# EAGLE design FabScan-Shield_v10 (EAGLE 6.6.0)
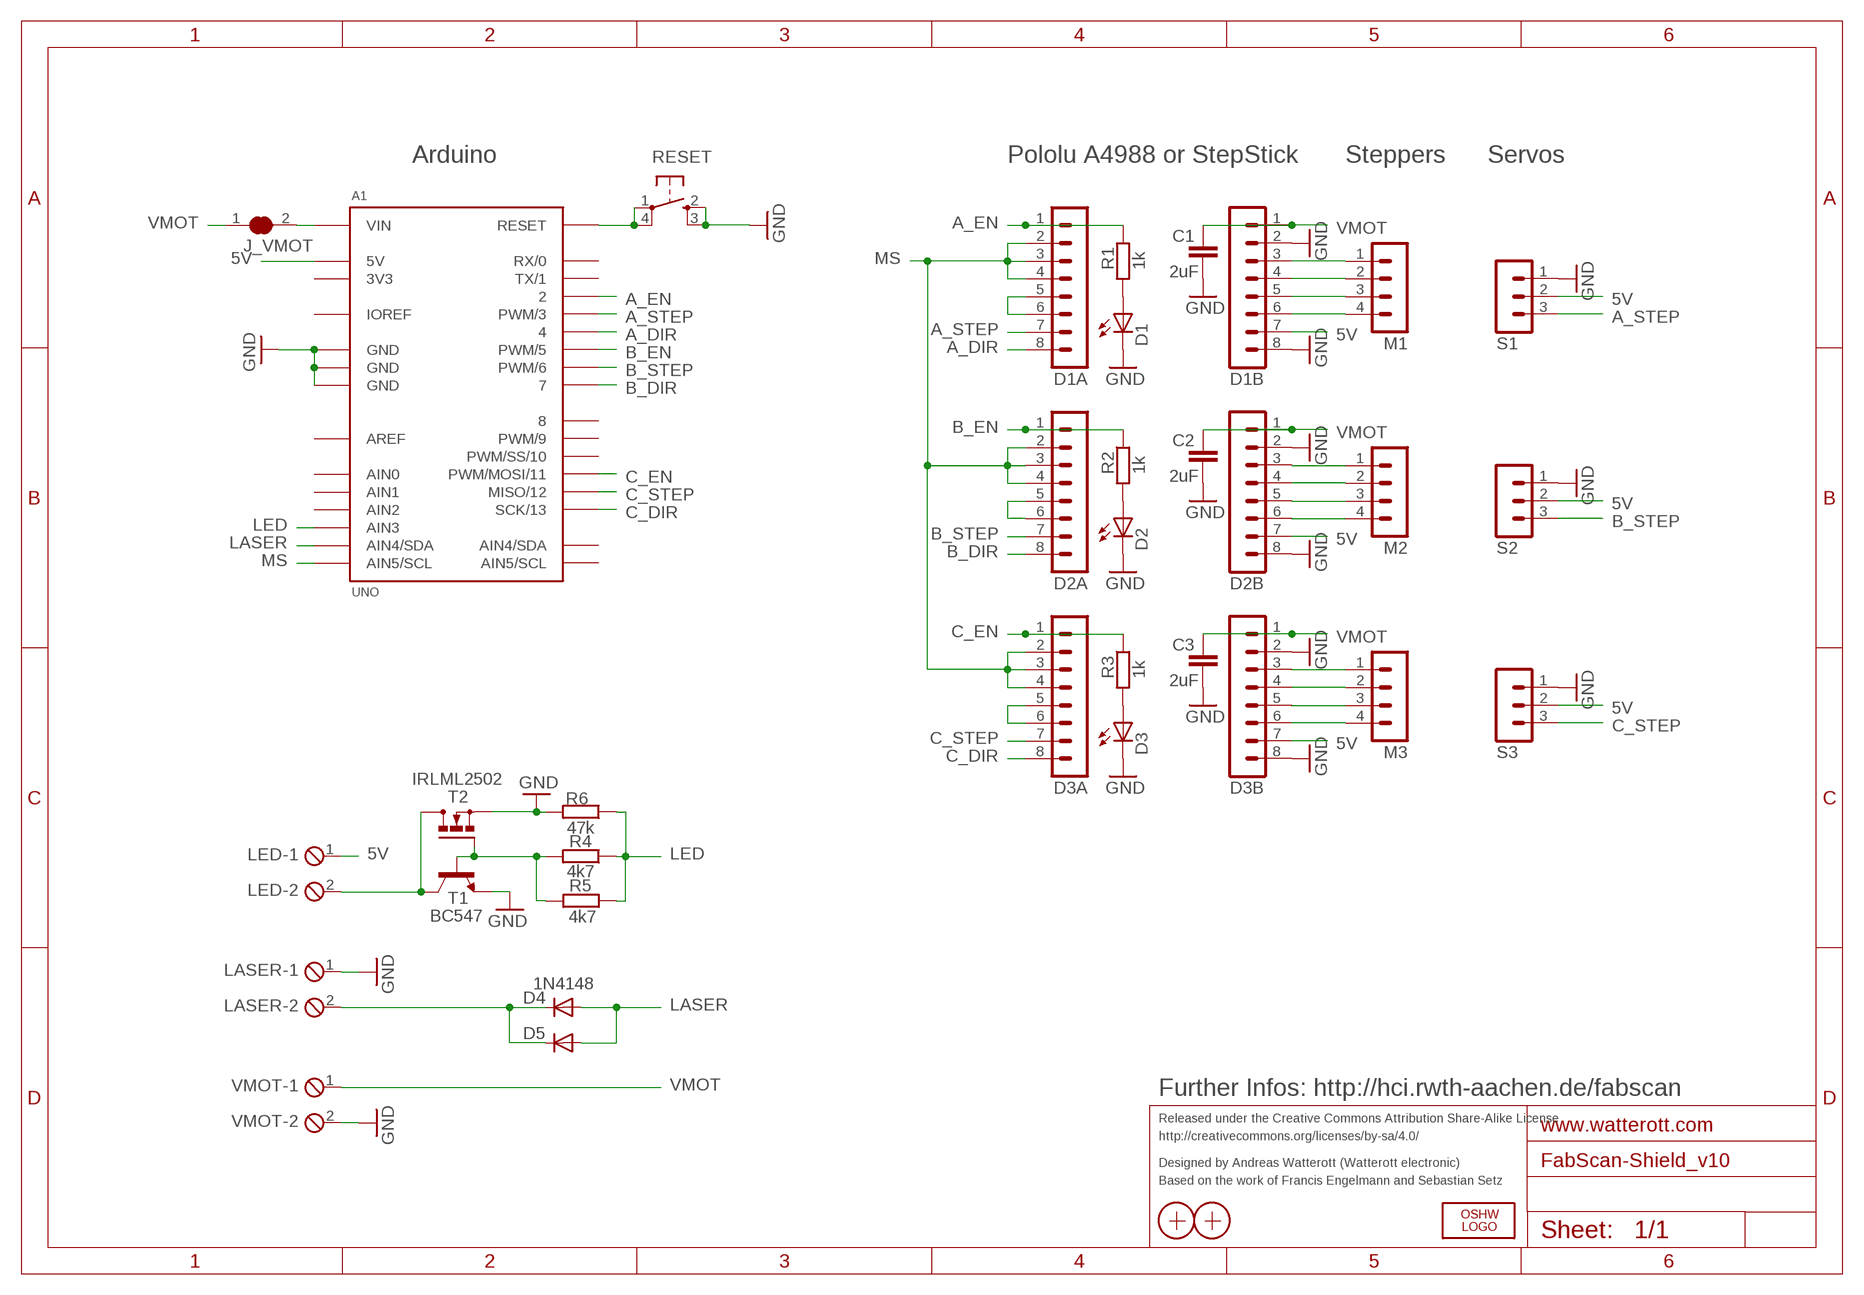
[diagram p0: schematic, sheet 1]

## Parts
A1  UNO  [UNO]
C1  2uF  C-EUC0603  [C0603]
C2  2uF  C-EUC0603  [C0603]
C3  2uF  C-EUC0603  [C0603]
D1  LEDCHIPLED_0603  [CHIPLED_0603]
D1A  MA08-1  [MA08-1]
D1B  MA08-1  [MA08-1]
D2  LEDCHIPLED_0603  [CHIPLED_0603]
D2A  MA08-1  [MA08-1]
D2B  MA08-1  [MA08-1]
D3  LEDCHIPLED_0603  [CHIPLED_0603]
D3A  MA08-1  [MA08-1]
D3B  MA08-1  [MA08-1]
D4  1N4148  1N4148DO35-7  [DO35-7]
D5  DIODE-SOD106-R  [SOD106-R]
J_VMOT  SJ  [SJ]
LASER  MPT2  [2POL254]
LED  MPT2  [2POL254]
LOGO2  OSHW_LOGO_6MILX0100-NT  [OSHW_6X100_NOTEXT]
M1  MA04-1  [MA04-1]
M2  MA04-1  [MA04-1]
M3  MA04-1  [MA04-1]
R1  1k  R-EU_R0603  [R0603]
R2  1k  R-EU_R0603  [R0603]
R3  1k  R-EU_R0603  [R0603]
R4  4k7  R-EU_0204/7  [0204/7]
R5  4k7  R-EU_R0603  [R0603]
R6  47k  R-EU_R0603  [R0603]
RESET  SW_SMDS  [SW_SMD4]
S1  MA03-1  [MA03-1]
S2  MA03-1  [MA03-1]
S3  MA03-1  [MA03-1]
T1  BC547  [TO92]
T2  IRLML2502  [MICRO3]
VMOT  MPT2  [2POL254]
X1  PASSER  [PASSER]
X2  PASSER  [PASSER]

## Nets
5V: A1.5V D1B.7 D2B.7 D3B.7 LED.1 S1.2 S2.2 S3.2
A_1A: D1B.5 M1.3
A_1B: D1B.6 M1.4
A_2A: D1B.4 M1.2
A_2B: D1B.3 M1.1
A_DIR: A1.4 D1A.8
A_EN: A1.2 D1A.1 R1.1
A_RST: D1A.5 D1A.6
A_STEP: A1.3(PWM/3) D1A.7 S1.3
B_1A: D2B.5 M2.3
B_1B: D2B.6 M2.4
B_2A: D2B.4 M2.2
B_2B: D2B.3 M2.1
B_DIR: A1.7 D2A.8
B_EN: A1.5(PWM/5) D2A.1 R2.1
B_STEP: A1.6(PWM/6) D2A.7 S2.3
C_1A: D3B.5 M3.3
C_1B: D3B.6 M3.4
C_2A: D3B.4 M3.2
C_2B: D3B.3 M3.1
C_DIR: A1.13(SCK/13) D3A.8
C_EN: A1.11(PWM/MOSI/11) D3A.1 R3.1
C_STEP: A1.12(MISO/12) D3A.7 S3.3
GND: A1.GND@1(GND) A1.GND@2(GND) A1.GND@3(GND) C1.2 C2.2 C3.2 D1.C D1B.2 D1B.8 D2.C D2B.2 D2B.8 D3.C D3B.2 D3B.8 LASER.1 R6.2 RESET.2(S) RESET.3(S1) S1.1 S2.1 S3.1 T1.1(E) T2.2(S) VMOT.2
LASER: A1.AIN4(AIN4/SDA) D4.A D5.A
LED: A1.AIN3 R4.1 R5.2 R6.1
MS: A1.AIN5(AIN5/SCL) D1A.2 D1A.3 D1A.4 D2A.2 D2A.3 D2A.4 D3A.2 D3A.3 D3A.4
N$1: D4.C D5.C LASER.2
N$2: D2.A R2.2
N$3: D3.A R3.2
N$6: LED.2 T1.3(C) T2.3(D)
N$8: R4.2 R5.1 T1.2(B) T2.1(G)
N$12: D1.A R1.2
N$20: D2A.5 D2A.6
N$28: D3A.5 D3A.6
RST: A1.RST(RESET) RESET.1(P) RESET.4(P1)
VIN: A1.VIN J_VMOT.2
VMOT: C1.1 C2.1 C3.1 D1B.1 D2B.1 D3B.1 J_VMOT.1 VMOT.1
Unconnected: A1.0(RX/0) A1.1(TX/1) A1.8 A1.9(PWM/9) A1.10(PWM/SS/10) A1.AIN0 A1.AIN1 A1.AIN2 A1.SCL(AIN5/SCL) A1.SDA(AIN4/SDA)

## Notes on the sheet
- Arduino | Pololu A4988 or StepStick | Steppers | Servos
- Further Infos: http://hci.rwth-aachen.de/fabscan
- Released under the Creative Commons Attribution Share-Alike License
- http://creativecommons.org/licenses/by-sa/4.0/
- Designed by Andreas Watterott (Watterott electronic)
- Based on the work of Francis Engelmann and Sebastian Setz

## Power pins joined to a net without a drawn wire
3V3: A1.3V3
AREF: A1.AREF
IOREF: A1.IOREF

## Library data of the parts
A1 = Arduino:UNO
C1-C3 = rcl:C-EU: CAPACITOR, European symbol
D1-D3 = led:LED: LED OSRAM: - CHIPLED LG R971, LG N971, LY N971, LG Q971, LY Q971, LO R971, LY R971 LH N974, LH R974 LS Q976, LO Q976, LY Q976 LO Q996 - Hyper CHIPLED LW Q18S LB Q993, LB Q99A, LB R99A - SideLED LS A670, LO A670, LY A670, LG A670, LP A670 LB A673, LV A673, LT A673, LW A673 LH A674 LY A675 LS A676, LA A676, LO A676, LY A676, LW A676 LS A679, LY A679, LG A679 - Hyper Micro SIDELED® LS Y876, LA Y876, LO Y876, LY Y876 LT Y87S - SmartLED LW L88C, LW L88S LB L89C, LB L89S, LG L890 LS L89K, LO L89K, LY L89K LS L896, LA L896, LO L896, LY L896 - TOPLED LS T670, LO T670, LY T670, LG T670, LP T670 LSG T670, LSP T670, LSY T670, LOP T670, LYG T670 LG T671, LOG T671, LSG T671 LB T673, LV T673, LT T673, LW T673 LH T674 LS T676, LA T676, LO T676, LY T676, LB T676, LH T676, LSB T676, LW T676 LB T67C, LV T67C, LT T67C, LS T67K, LO T67K, LY T67K, LW E67C LS E67B, LA E67B, LO E67B, LY E67B, LB E67C, LV E67C, LT E67C LW T67C LS T679, LY T679, LG T679 LS T770, LO T770, LY T770, LG T770, LP T770 LB T773, LV T773, LT T773, LW T773 LH T774 LS E675, LA E675, LY E675, LS T675 LS T776, LA T776, LO T776, LY T776, LB T776 LHGB T686 LT T68C, LB T68C - Hyper Mini TOPLED® LB M676 - Mini TOPLED Santana® LG M470 LS M47K, LO M47K, LY M47K Source: http://www.osram.convergy.de LUXEON: - LUMILED® LXK2-PW12-R00, LXK2-PW12-S00, LXK2-PW14-U00, LXK2-PW14-V00 LXK2-PM12-R00, LXK2-PM12-S00, LXK2-PM14-U00 LXK2-PE12-Q00, LXK2-PE12-R00, LXK2-PE12-S00, LXK2-PE14-T00, LXK2-PE14-U00 LXK2-PB12-K00, LXK2-PB12-L00, LXK2-PB12-M00, LXK2-PB14-N00, LXK2-PB14-P00, LXK2-PB14-Q00 LXK2-PR12-L00, LXK2-PR12-M00, LXK2-PR14-Q00, LXK2-PR14-R00 LXK2-PD12-Q00, LXK2-PD12-R00, LXK2-PD12-S00 LXK2-PH12-R00, LXK2-PH12-S00 LXK2-PL12-P00, LXK2-PL12-Q00, LXK2-PL12-R00 Source: www.luxeon.com KINGBRIGHT: KA-3528ASYC Source: www.kingbright.com
D1A D1B D2A D2B D3A D3B = con-lstb:MA08-1: PIN HEADER; OC_FARNELL: unknown; OC_NEWARK: unknown
D4 = diode:1N4148: DIODE high speed (Philips)
D5 = diode:DIODE-: DIODE
J_VMOT = jumper:SJ: SMD solder JUMPER
LASER LED VMOT = con-phoenix-254:MPT2: PHOENIX CONNECTOR; OC_FARNELL: unknown; OC_NEWARK: unknown
LOGO2 = OSHW:OSHW_LOGO_6MIL
M1-M3 = con-lstb:MA04-1: PIN HEADER; OC_FARNELL: unknown; OC_NEWARK: unknown
R1-R6 = rcl:R-EU_: RESISTOR, European symbol
RESET = Switch-SMD:SW_SMD
S1-S3 = con-lstb:MA03-1: PIN HEADER; OC_FARNELL: unknown; OC_NEWARK: unknown
T1 = transistor:BC547: NPN TRANSISTOR
T2 = IRF-sot23:IRLML2502: N-Channel Power MOSFET
X1 X2 = SMD:PASSER

## Board
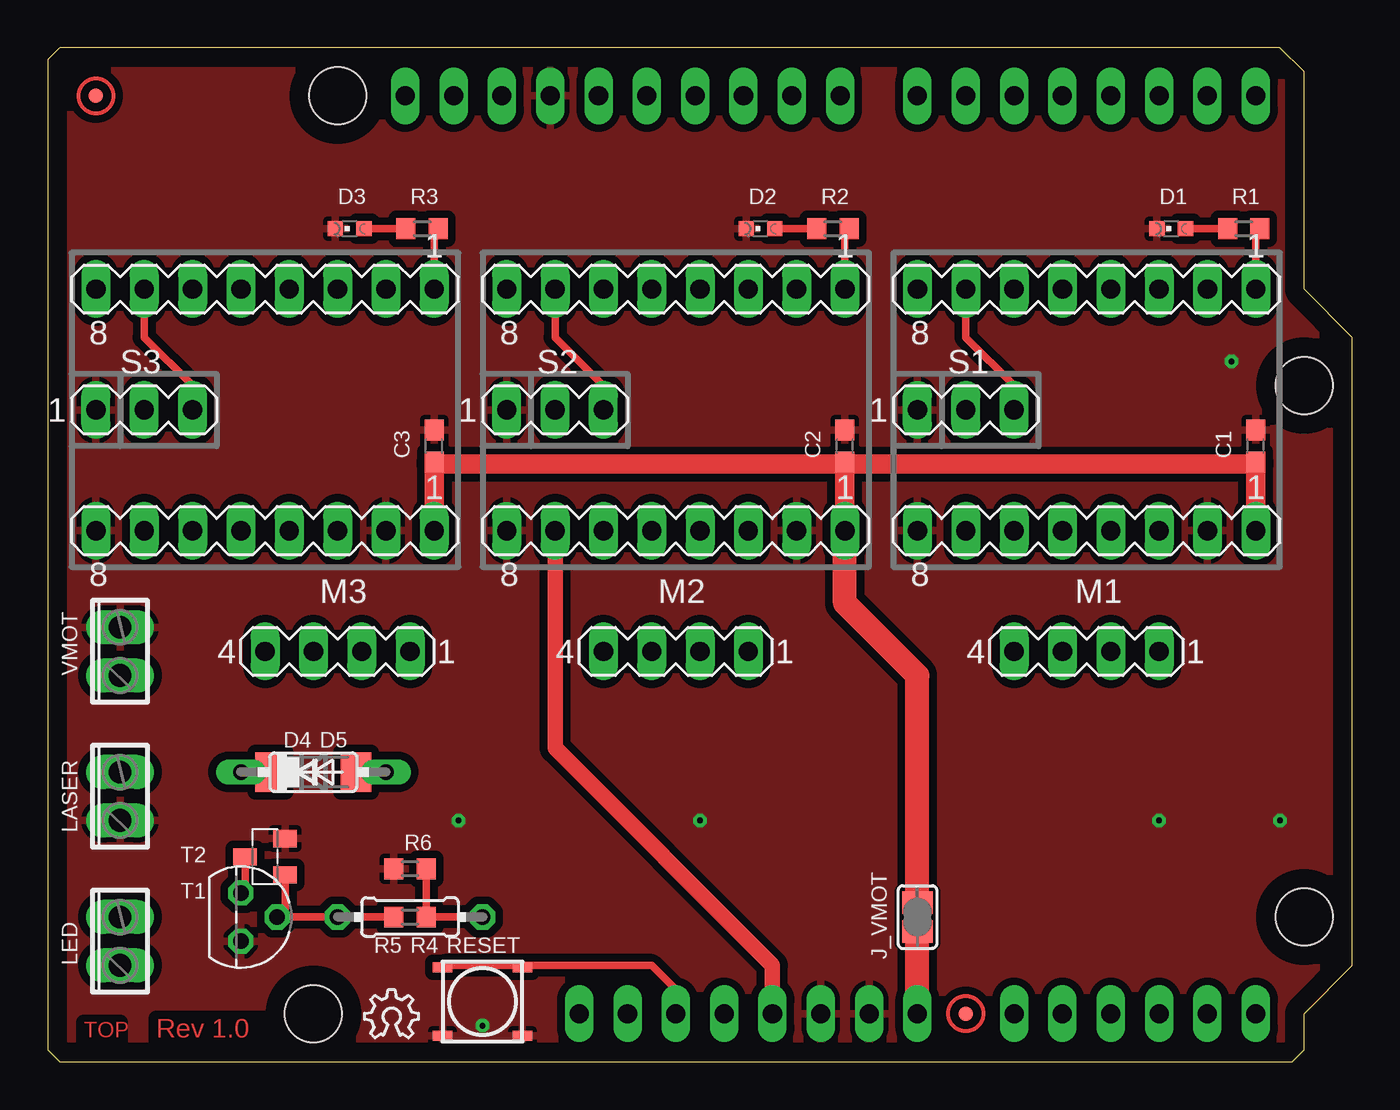
[diagram p1: board, top side]
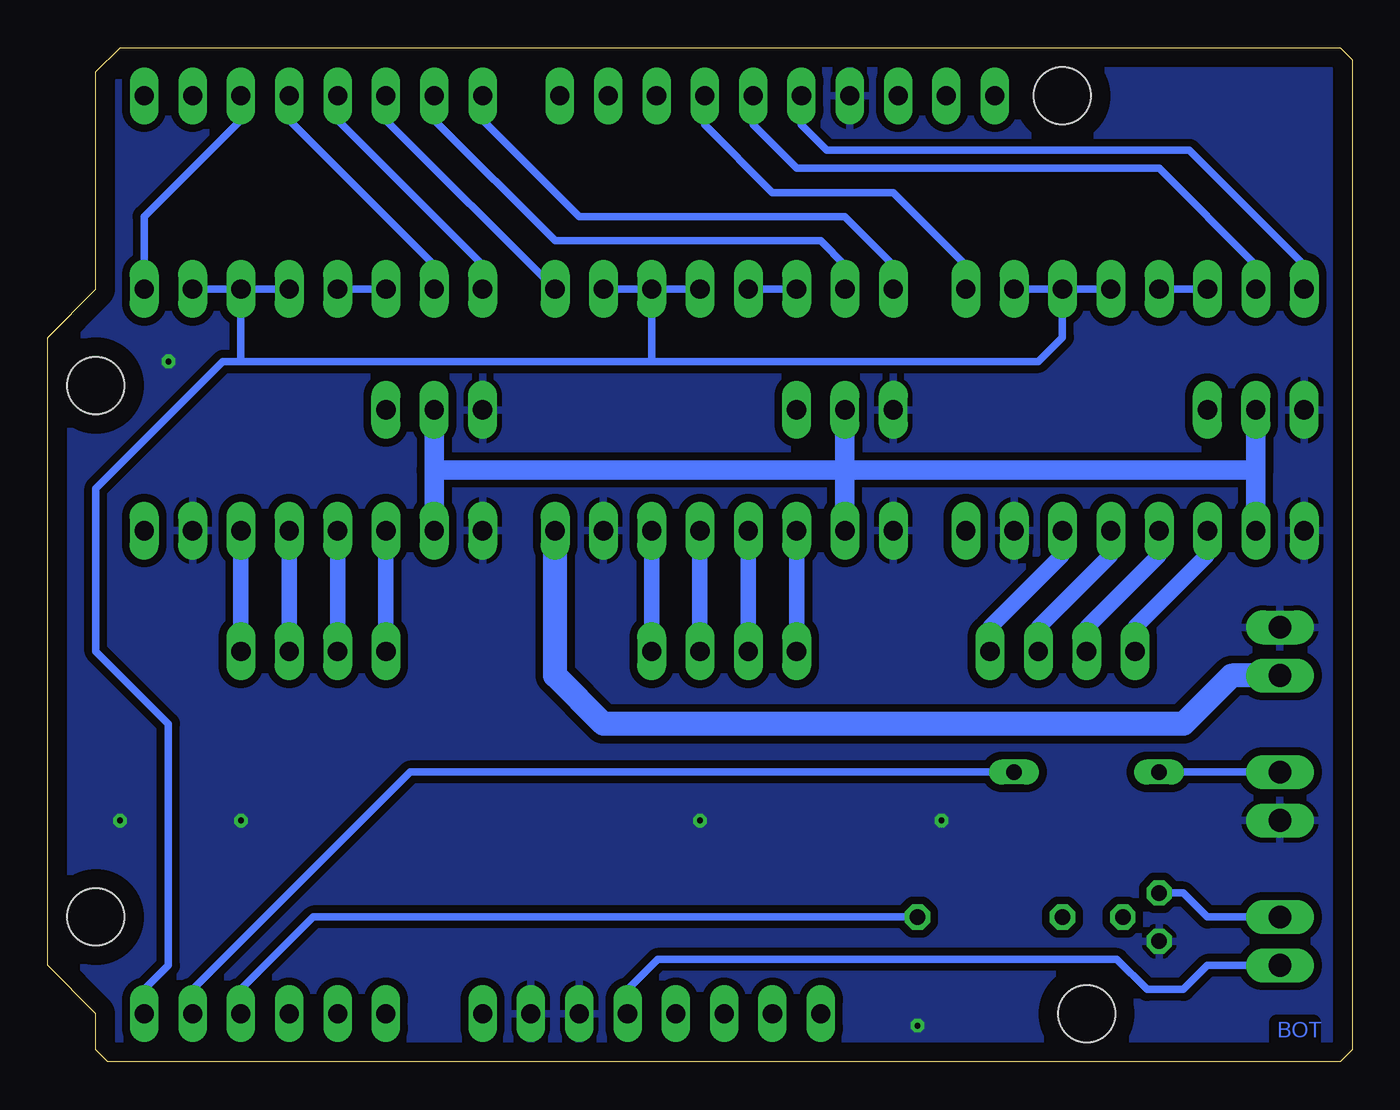
[diagram p2: board, bottom side, seen from below]

Size 68.58 x 53.34 mm. Coordinates in mm from the lower left corner, seen from the top.
Copper layers (1*16): Top 0.035mm / dielectric 1.5mm / Bottom 0.035mm
Design rules "default": minimum track width 8mil, minimum drill 0.3mm, track to track 8mil, track to pad 8mil, pad to pad 8mil, via to via 8mil, smd to smd 8mil, copper to edge 40mil, drill to drill 8mil, minimum pad ring 10mil, minimum via ring 8mil, stop-mask expansion 4mil, vias tented up to drill 0.5mm, thermal gap 10mil

### Footprints (pad centres in the part's own frame; a part is rotated, then mirrored left to right if it is on the bottom)
UNO = drill 1 long: 0 63.5,50.8; 1 60.96,50.8; 2 58.42,50.8; 3 55.88,50.8; 3V3 35.56,2.54; 4 53.34,50.8; 5 50.8,50.8; 5V 38.1,2.54; 6 48.26,50.8; 7 45.72,50.8; 8 41.656,50.8; 9 39.116,50.8; 10 36.576,50.8; 11 34.036,50.8; 12 31.496,50.8; 13 28.956,50.8; AIN0 50.8,2.54; AIN1 53.34,2.54; AIN2 55.88,2.54; AIN3 58.42,2.54; AIN4 60.96,2.54; AIN5 63.5,2.54; AREF 23.876,50.8; GND@1 40.64,2.54; GND@2 43.18,2.54; GND@3 26.416,50.8; IOREF 30.48,2.54; NC 27.94,2.54; RST 33.02,2.54; SCL 18.796,50.8; SDA 21.336,50.8; VIN 45.72,2.54 | hole 3: 66.04,35.56; 66.04,7.62; 15.24,50.8; 13.97,2.54
C0603 = smd 1.1 x 1: 1 -0.85,0; 2 0.85,0
CHIPLED_0603 = smd 0.8 x 0.8: A 0,-0.75; C 0,0.75
MA08-1 = drill 1.016 long: 1 -8.89,0; 2 -6.35,0; 3 -3.81,0; 4 -1.27,0; 5 1.27,0; 6 3.81,0; 7 6.35,0; 8 8.89,0
DO35-7 = drill 0.813 long: A 3.81,0; C -3.81,0
SOD106-R = smd 1.6 x 2.1: A 2.25,0; C -2.25,0
SJ = smd 1.168 x 1.6: 1 -0.762,0; 2 0.762,0
2POL254 = drill 1.2 long: 1 -1.27,0; 2 1.27,0
MA04-1 = drill 1.016 long: 1 -3.81,0; 2 -1.27,0; 3 1.27,0; 4 3.81,0
R0603 = smd 1 x 1.1: 1 -0.85,0; 2 0.85,0
0204/7 = drill 0.813 octagon: 1 -3.81,0; 2 3.81,0
SW_SMD4 = smd 0.508 x 1.016: 1 -1.8,-2.1; 2 1.8,-2.1; 3 1.8,2.1; 4 -1.8,2.1
MA03-1 = drill 1.016 long: 1 -2.54,0; 2 0,0; 3 2.54,0
TO92 = drill 0.813 octagon: 1 1.27,0; 2 0,1.905; 3 -1.27,0
MICRO3 = smd 0.9 x 1.25: 1 -0.95,-1.05; 2 0.95,-1.05; 3 0,1.05
PASSER = smd 0.762 x 0.762: X 0,0

### Placement (x,y rotation side)
A1  0,0 0 top
C1  63.5,32.38 90 top
C2  41.91,32.38 90 top
C3  20.32,32.38 90 top
D1  59.05,43.81 90 top
D1A  54.61,40.64 180 top
D1B  54.61,27.94 180 top
D2  37.47,43.81 90 top
D2A  33.02,40.64 180 top
D2B  33.02,27.94 180 top
D3  15.88,43.81 90 top
D3A  11.43,40.64 180 top
D3B  11.43,27.94 180 top
D4  13.97,15.24 0 top
D5  13.97,15.24 0 top
J_VMOT  45.72,7.62 270 top
LASER  3.81,13.97 90 top
LED  3.81,6.35 90 top
LOGO2  16.67,1.27 0 top
M1  54.61,21.59 180 top
M2  33.02,21.59 180 top
M3  15.24,21.59 180 top
R1  62.87,43.81 180 top
R2  41.27,43.81 180 top
R3  19.68,43.81 180 top
R4  19.05,7.62 180 top
R5  19.05,7.62 0 top
R6  19.05,10.16 180 top
RESET  22.86,3.17 270 top
S1  48.26,34.29 0 top
S2  26.67,34.29 0 top
S3  5.08,34.29 0 top
T1  10.16,7.62 270 top
T2  11.43,10.79 90 top
VMOT  3.81,21.59 90 top
X1  2.54,50.8 0 top
X2  48.26,2.54 0 top

### Tracks (layer width: path | path; a pad name or v marks a point on that pad's centre or on a via)
5V
  Top 0.813: A1.5V 38.1,5.08 26.67,16.51 D2B.7
  Bottom 0.406: LED.1 7.62,5.08 8.89,3.81 10.79,3.81 12.38,5.4 36.51,5.4 38.1,3.81 A1.5V
  Bottom 1.016: D3B.7 5.08,31.11 | 5.08,31.11 26.67,31.11 | 26.67,31.11 48.26,31.11 | 48.26,31.11 D1B.7 | D2B.7 26.67,31.11 | S3.2 5.08,31.11 | S2.2 26.67,31.11 | S1.2 48.26,31.11
A_1A
  Bottom 0.813: D1B.5 M1.3
A_1B
  Bottom 0.813: D1B.6 M1.4
A_2A
  Bottom 0.813: D1B.4 M1.2
A_2B
  Bottom 0.813: D1B.3 M1.1
A_DIR
  Bottom 0.406: A1.4 53.34,49.53 45.72,41.91 D1A.8
A_EN
  Top 0.406: R1.1 63.5,43.81 D1A.1
  Bottom 0.406: A1.2 58.42,49.53 63.5,44.45 D1A.1
A_RST
  Bottom 0.406: D1A.6 D1A.5
A_STEP
  Top 0.406: D1A.7 48.26,38.1 50.8,35.56 S1.3
  Bottom 0.406: A1.3 55.88,49.53 48.26,41.91 D1A.7
B_1A
  Bottom 0.813: D2B.5 M2.3
B_1B
  Bottom 0.813: D2B.6 M2.4
B_2A
  Bottom 0.813: D2B.4 M2.2
B_2B
  Bottom 0.813: D2B.3 M2.1
B_DIR
  Bottom 0.406: A1.7 45.72,49.53 40.64,44.45 26.67,44.45 24.13,41.91 D2A.8
B_EN
  Top 0.406: R2.1 41.91,43.81 D2A.1
  Bottom 0.406: A1.5 50.8,49.53 D2A.1
B_STEP
  Top 0.406: D2A.7 26.67,38.1 29.21,35.56 S2.3
  Bottom 0.406: A1.6 48.26,49.53 41.91,43.18 27.94,43.18 26.67,41.91 D2A.7
C_1A
  Bottom 0.813: D3B.5 10.16,26.67 13.97,22.86 M3.3
C_1B
  Bottom 0.813: D3B.6 7.62,26.67 11.43,22.86 M3.4
C_2A
  Bottom 0.813: D3B.4 12.7,26.67 16.51,22.86 M3.2
C_2B
  Bottom 0.813: D3B.3 15.24,26.67 19.05,22.86 M3.1
C_DIR
  Bottom 0.406: A1.13 28.96,49.28 27.62,47.94 8.57,47.94 2.54,41.91 D3A.8
C_EN
  Top 0.406: R3.1 20.32,43.81 D3A.1
  Bottom 0.406: A1.11 34.04,49.28 30.48,45.72 24.13,45.72 20.32,41.91 D3A.1
C_STEP
  Top 0.406: D3A.7 5.08,38.1 7.62,35.56 S3.3
  Bottom 0.406: A1.12 31.5,49.28 29.21,46.99 10.16,46.99 5.08,41.91 D3A.7
GND  (via drill 0.3)
  other vias: 58.42,12.7 64.77,12.7 34.29,12.7 62.23,36.83 22.86,1.91 21.59,12.7
  pour Bottom (isolate 0.406): 0,53.34 68.58,53.34 68.58,0 0,0
  pour Top (isolate 0.406): 0,0 0,53.34 68.58,53.34 68.58,0
LASER
  Top 0.406: D5.A D4.A
  Bottom 0.406: D4.A 49.53,15.24 60.96,3.81 A1.AIN4
LED
  Top 0.406: R4.1 R5.2 R6.1
  Bottom 0.406: R4.1 54.61,7.62 58.42,3.81 A1.AIN3
MS
  Bottom 0.406: D3A.4 D3A.3 | D3A.3 D3A.2 | D2A.3 D2A.2 | D1A.4 D1A.3 | D1A.2 D1A.3 | D1A.3 58.42,36.83 | 58.42,36.83 36.83,36.83 | D2A.4 D2A.3 | D2A.3 36.83,36.83 | 36.83,36.83 16.51,36.83 15.24,38.1 D3A.3 | A1.AIN5 63.5,3.81 62.23,5.08 62.23,17.78 66.04,21.59 66.04,30.16 59.37,36.83 58.42,36.83
N$1
  Top 0.406: D4.C D5.C
  Bottom 0.406: LASER.2 D4.C
N$2
  Top 0.406: D2.A R2.2
N$3
  Top 0.406: D3.A R3.2
N$6
  Top 0.406: T2.3 10.38,9.11 T1.3
  Bottom 0.406: LED.2 7.62,7.62 8.89,8.89 T1.3
N$8
  Top 0.406: T2.1 12.48,8.04 T1.2 R4.2 R5.1
N$12
  Top 0.406: D1.A R1.2
N$13
  Top 0.406: 45.72,8.26 45.72,6.99
N$20
  Bottom 0.406: D2A.6 D2A.5
N$28
  Bottom 0.406: D3A.6 D3A.5
RST
  Top 0.406: A1.RST 33.02,3.81 31.75,5.08 25.08,5.08 | 25.08,5.08 25.07,5.08 | 25.07,5.08 RESET.4 24.98,4.97 25.08,5.08 | 25.07,5.08 20.86,5.08 RESET.1
VIN
  Top 1.27: A1.VIN J_VMOT.2
VMOT
  Top 0.406: 41.91,31.65 C2.1
  Top 1.016: D3B.1 C3.1 20.32,31.43 41.91,31.43 | D2B.1 C2.1 41.91,31.43 | 41.91,31.43 63.5,31.43 C1.1 D1B.1
  Top 1.27: J_VMOT.1 45.72,20.32 41.91,24.13 D2B.1
  Bottom 1.27: VMOT.1 6.35,20.32 8.89,17.78 39.37,17.78 41.91,20.32 D2B.1

### Text on the board
Top: TOP | Rev 1.0
Bottom: BOT
Reference: Silkscreen: 51 tDocu
tDocu: Dir | En | Dir | En | Dir | En | 3 | 2 | 1 | - | + | S | - | + | S | - | + | S | GND | VMot | GND | VMot | GND | VMot | GND | 1B 1A 2A 2B | 1B 1A 2A 2B | 1B 1A 2A 2B | VMot | Power | FabScan-Shield | GND | Laser | Reset | LED | VMot-Vin | 5V